# Altium project DC075B.PrjPcb (part 7 of 7)

## Sheet DC075B_CW_OUTPUTS.SchDoc: CW OUTPUTS
size 558 x 431 mm; DrawnBy: Praveen Aroul; DocumentNumber: 12; SheetNumber: 12; SheetTotal: 13; PageSetup: Record=PageOptions|CenterHorizontal=True|CenterVertical=True|PrintScale=1.00|XCorrection=1.00|YCorrection=1.00|PrintKind=0|BorderSize=5000000|LeftOffset=0|BottomOffset=0|Orientation=2|PaperLength=1000|PaperWidth=1000|Scale=100|PaperSource=15|PrintQuality=600|MediaType=1|DitherType=10|PaperKind=Letter|PrintScaleMode=1
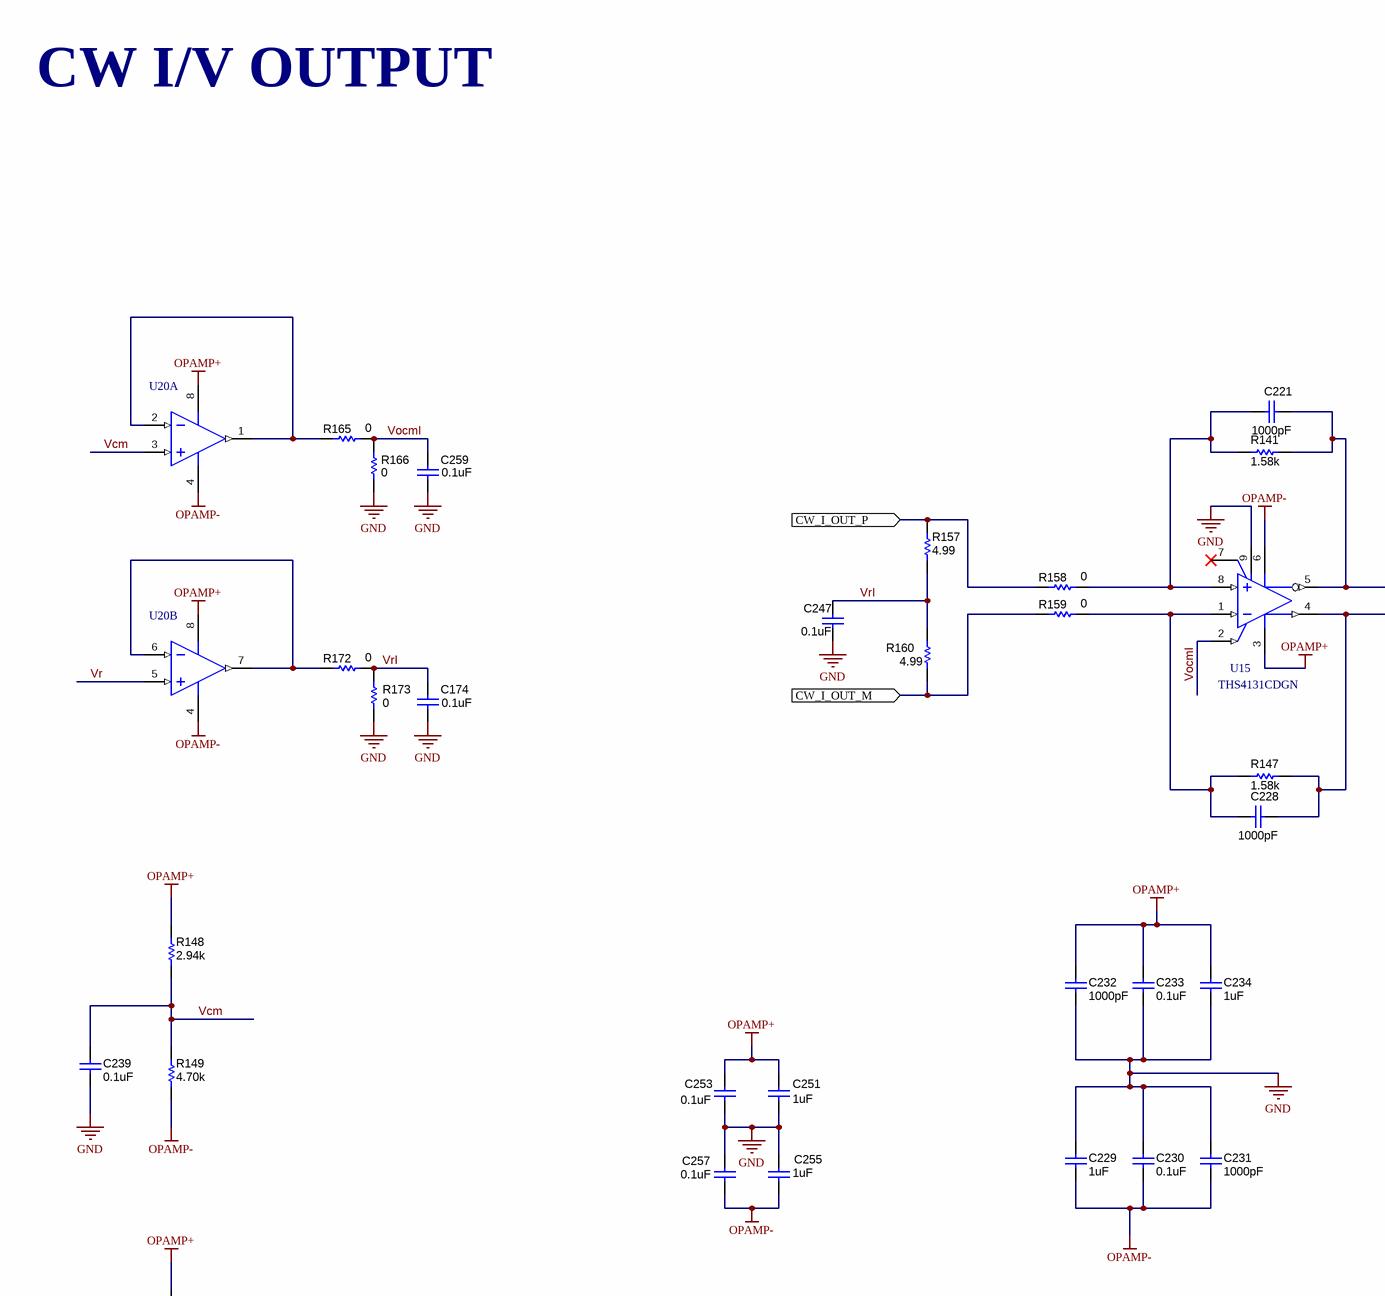
[diagram p27: DC075B_CW_OUTPUTS.SchDoc, top left]
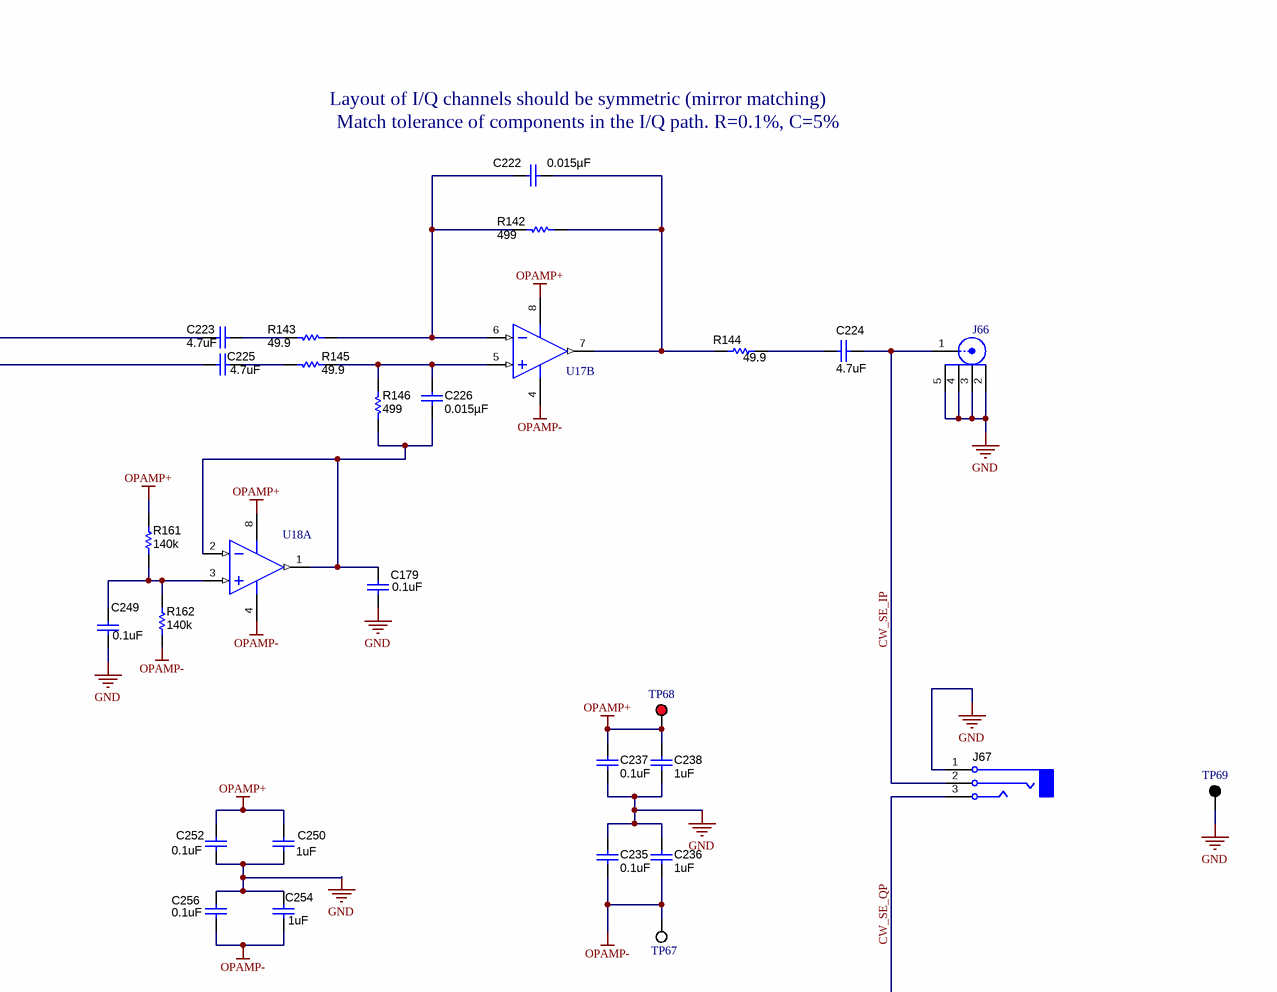
[diagram p28: DC075B_CW_OUTPUTS.SchDoc, top right]
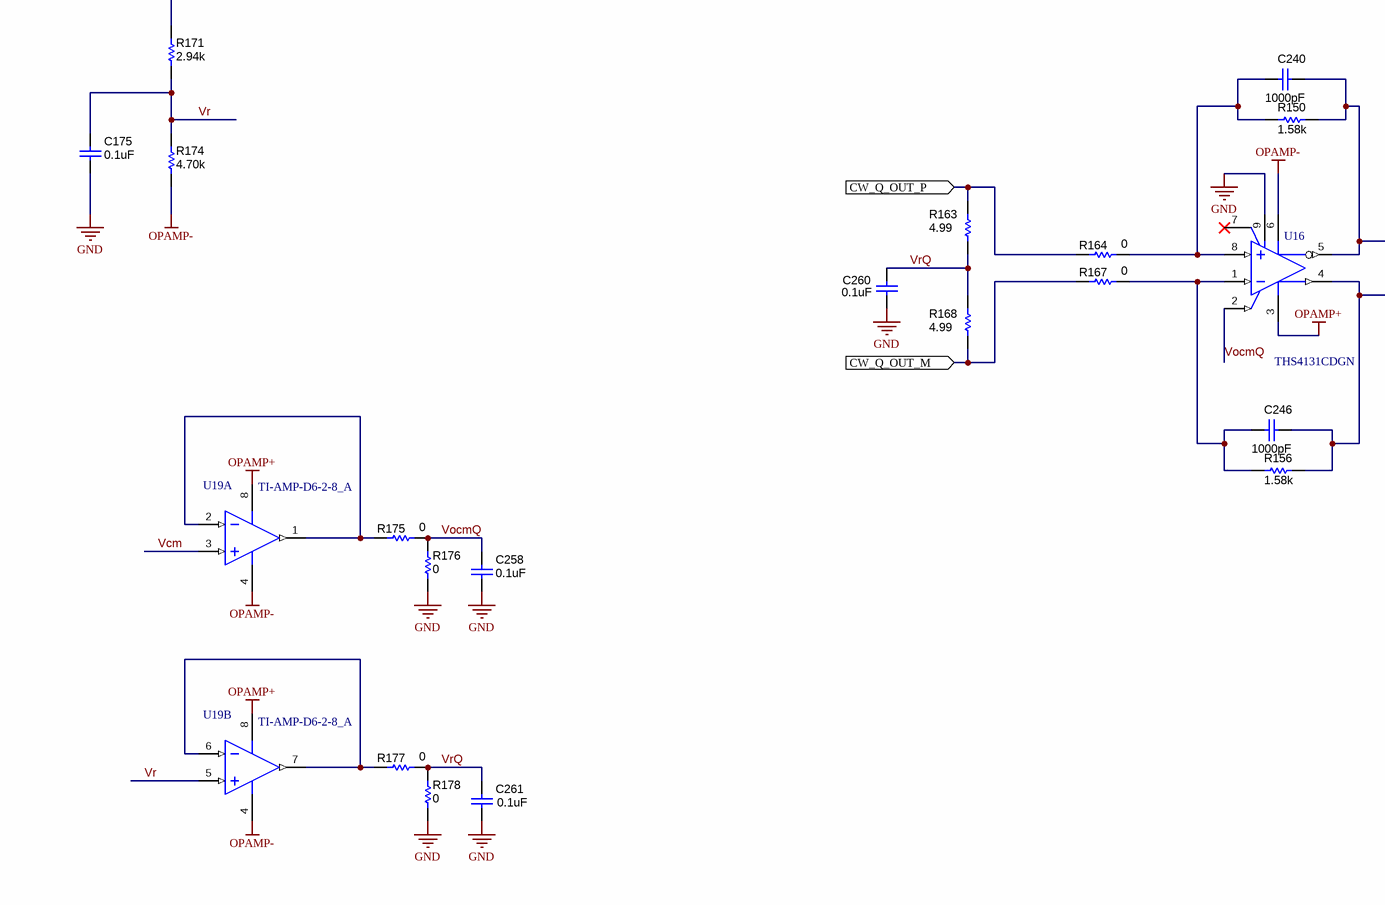
[diagram p29: DC075B_CW_OUTPUTS.SchDoc, bottom left]
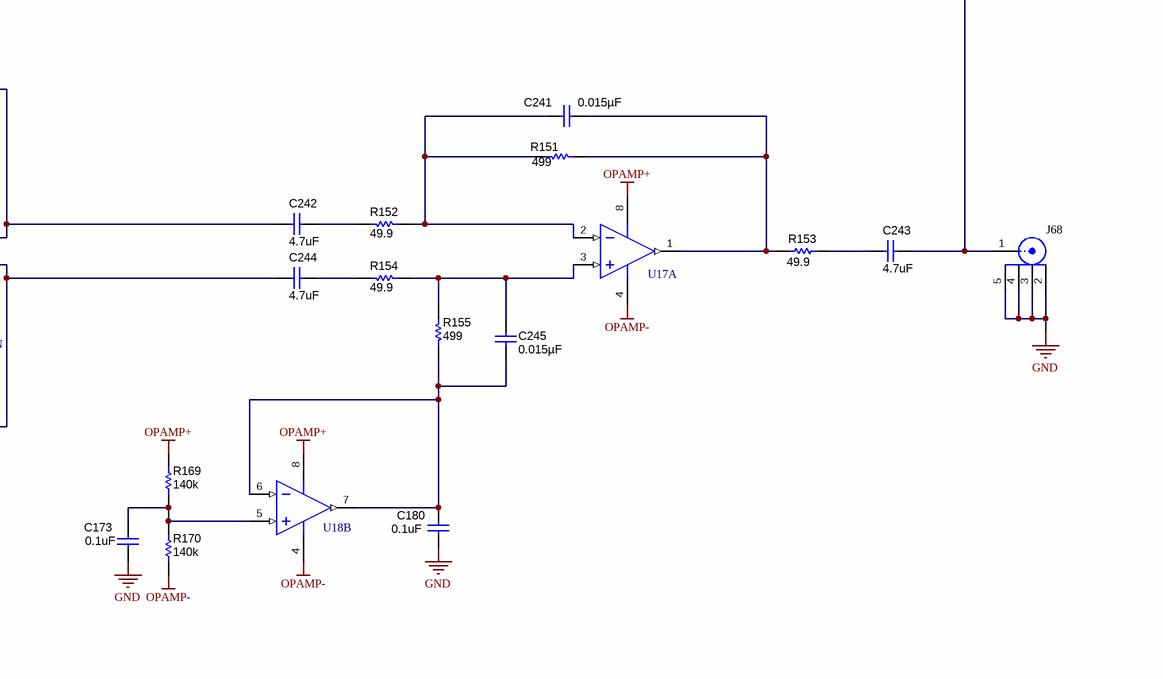
[diagram p30: DC075B_CW_OUTPUTS.SchDoc, bottom right]

### Parts
C173  value 0.1uF  [0402]  (hidden comment: Capacitor)
C174  value 0.1uF  [0402]  (hidden comment: Capacitor)
C175  value 0.1uF  [0402]  (hidden comment: Capacitor)
C179  value 0.1uF  [0402]  (hidden comment: Capacitor)
C180  value 0.1uF  [0402]  (hidden comment: Capacitor)
C221  ValueDisplayed: 1000pF  [0402]  (hidden comment: 885012205044)
C222  ValueDisplayed: 0.015µF  [0402]  (hidden comment: C0402C153J4RAC7867)
C223  ValueDisplayed: 4.7uF  [0603]  (hidden comment: Capacitor)
C224  ValueDisplayed: 4.7uF  [0603]  (hidden comment: Capacitor)
C225  ValueDisplayed: 4.7uF  [0603]  (hidden comment: Capacitor)
C226  ValueDisplayed: 0.015µF  [0402]  (hidden comment: C0402C153J4RAC7867)
C228  ValueDisplayed: 1000pF  [0402]  (hidden comment: 885012205044)
C229  value 1uF  [0603_HV]  (hidden comment: Capacitor)
C230  value 0.1uF  [0402]  (hidden comment: Capacitor)
C231  ValueDisplayed: 1000pF  [0402]  (hidden comment: 885012205044)
C232  ValueDisplayed: 1000pF  [0402]  (hidden comment: 885012205044)
C233  value 0.1uF  [0402]  (hidden comment: Capacitor)
C234  value 1uF  [0603_HV]  (hidden comment: Capacitor)
C235  value 0.1uF  [0402]  (hidden comment: Capacitor)
C236  value 1uF  [0603_HV]  (hidden comment: Capacitor)
C237  value 0.1uF  [0402]  (hidden comment: Capacitor)
C238  value 1uF  [0603_HV]  (hidden comment: Capacitor)
C239  value 0.1uF  [0402]  (hidden comment: Capacitor)
C240  ValueDisplayed: 1000pF  [0402]  (hidden comment: 885012205044)
C241  ValueDisplayed: 0.015µF  [0402]  (hidden comment: C0402C153J4RAC7867)
C242  ValueDisplayed: 4.7uF  [0603]  (hidden comment: Capacitor)
C243  ValueDisplayed: 4.7uF  [0603]  (hidden comment: Capacitor)
C244  ValueDisplayed: 4.7uF  [0603]  (hidden comment: Capacitor)
C245  ValueDisplayed: 0.015µF  [0402]  (hidden comment: C0402C153J4RAC7867)
C246  ValueDisplayed: 1000pF  [0402]  (hidden comment: 885012205044)
C247  value 0.1uF  [0402]  (hidden comment: Capacitor)
C249  value 0.1uF  [0402]  (hidden comment: Capacitor)
C250  value 1uF  [0603_HV]  (hidden comment: Capacitor)
C251  value 1uF  [0603_HV]  (hidden comment: Capacitor)
C252  value 0.1uF  [0402]  (hidden comment: Capacitor)
C253  value 0.1uF  [0402]  (hidden comment: Capacitor)
C254  value 1uF  [0603_HV]  (hidden comment: Capacitor)
C255  value 1uF  [0603_HV]  (hidden comment: Capacitor)
C256  value 0.1uF  [0402]  (hidden comment: Capacitor)
C257  value 0.1uF  [0402]  (hidden comment: Capacitor)
C258  value 0.1uF  [0402]  (hidden comment: Capacitor)
C259  value 0.1uF  [0402]  (hidden comment: Capacitor)
C260  value 0.1uF  [0402]  (hidden comment: Capacitor)
C261  value 0.1uF  [0402]  (hidden comment: Capacitor)
J66  5-1814832-1  [TE_5-1814832-1]  (value not drawn)
J67  Audio_T3R2S1  [KYCON_STX-3000]  (value not drawn)
J68  5-1814832-1  [TE_5-1814832-1]  (value not drawn)
R141  ValueDisplayed: 1.58k  [0402]  (hidden comment: CRCW04021K58FKED)
R142  ValueDisplayed: 499  [0402]  (hidden comment: Resistor)
R143  ValueDisplayed: 49.9  [0402]  (hidden comment: Resistor)
R144  value 49.9  [0402]  (hidden comment: Resistor)
R145  ValueDisplayed: 49.9  [0402]  (hidden comment: Resistor)
R146  ValueDisplayed: 499  [0402]  (hidden comment: Resistor)
R147  ValueDisplayed: 1.58k  [0402]  (hidden comment: CRCW04021K58FKED)
R148  ValueDisplayed: 2.94k  [0402]  (hidden comment: CRCW04022K94FKED)
R149  ValueDisplayed: 4.70k  [0402]  (hidden comment: Resistor)
R150  ValueDisplayed: 1.58k  [0402]  (hidden comment: CRCW04021K58FKED)
R151  ValueDisplayed: 499  [0402]  (hidden comment: Resistor)
R152  ValueDisplayed: 49.9  [0402]  (hidden comment: Resistor)
R153  value 49.9  [0402]  (hidden comment: Resistor)
R154  ValueDisplayed: 49.9  [0402]  (hidden comment: Resistor)
R155  ValueDisplayed: 499  [0402]  (hidden comment: Resistor)
R156  ValueDisplayed: 1.58k  [0402]  (hidden comment: CRCW04021K58FKED)
R157  ValueDisplayed: 4.99  [0402]  (hidden comment: Resistor)
R158  value 0  [0402]  (hidden comment: Resistor)
R159  value 0  [0402]  (hidden comment: Resistor)
R160  ValueDisplayed: 4.99  [0402]  (hidden comment: Resistor)
R161  ValueDisplayed: 140k  [0402]  (hidden comment: Resistor)
R162  ValueDisplayed: 140k  [0402]  (hidden comment: Resistor)
R163  ValueDisplayed: 4.99  [0402]  (hidden comment: Resistor)
R164  value 0  [0402]  (hidden comment: Resistor)
R165  value 0  [0402]  (hidden comment: Resistor)
R166  value 0  [0402]  (hidden comment: Resistor)
R167  value 0  [0402]  (hidden comment: Resistor)
R168  ValueDisplayed: 4.99  [0402]  (hidden comment: Resistor)
R169  ValueDisplayed: 140k  [0402]  (hidden comment: Resistor)
R170  ValueDisplayed: 140k  [0402]  (hidden comment: Resistor)
R171  ValueDisplayed: 2.94k  [0402]  (hidden comment: CRCW04022K94FKED)
R172  value 0  [0402]  (hidden comment: Resistor)
R173  value 0  [0402]  (hidden comment: Resistor)
R174  ValueDisplayed: 4.70k  [0402]  (hidden comment: Resistor)
R175  value 0  [0402]  (hidden comment: Resistor)
R176  value 0  [0402]  (hidden comment: Resistor)
R177  value 0  [0402]  (hidden comment: Resistor)
R178  value 0  [0402]  (hidden comment: Resistor)
TP67  5002  [Keystone5002]  (value not drawn)
TP68  5000  [Keystone5000]  (value not drawn)
TP69  5001  [Keystone5001]  (value not drawn)
U15  THS4131CDGN  [DGN0008D_N]
U16  THS4131CDGN  [DGN0008D_N]
U17  TI-AMP-D6-2-8_A  [D0008A_N]  (value not drawn)  (parts A,B of 2)
U18  TI-AMP-D6-2-8_A  [D0008A_N]  (value not drawn)  (parts A,B of 2)
U19  TI-AMP-D6-2-8_A  [D0008A_N]  (parts A,B of 2)
U20  TI-AMP-D6-2-8_A  [D0008A_N]  (value not drawn)  (parts A,B of 2)

### Ports
CW_I_OUT_M (in), CW_I_OUT_P (in), CW_Q_OUT_M (in), CW_Q_OUT_P (in)

### Nets
GND: C173.1 C174.2 C175.1 C179.2 C180.2 C229.1 C230.1 C231.2 C232.2 C233.1 C234.1 C235.2 C236.2 C237.2 C238.2 C239.1 C247.2 C249.1 C250.2 C251.2 C252.2 C253.2 C254.1 C255.1 C256.1 C257.1 C258.2 C259.2 C260.2 C261.2 J66.2 J66.3 J66.4 J66.5 J67.1(SLEEVE) J68.2 J68.3 J68.4 J68.5 R166.2 R173.2 R176.2 R178.2 TP69.1 U15.9(EP) U16.9(EP)
OPAMP+: C232.1 C233.2 C234.2 C237.1 C238.1 C250.1 C251.1 C252.1 C253.1 R148.2 R161.2 R169.2 R171.2 TP68.1 U15.3(VCC+) U16.3(VCC+) U17.8(VS+) U18.8(VS+) U19.8(VS+) U20.8(VS+)
OPAMP-: C229.2 C230.2 C231.1 C235.1 C236.1 C254.2 C255.2 C256.2 C257.2 R149.1 R162.1 R170.1 R174.1 TP67.1 U15.6(VCC-) U16.6(VCC-) U17.4(VS-) U18.4(VS-) U19.4(VS-) U20.4(VS-)
CW_I_OUT_M: R159.2 R160.1 ; port CW_I_OUT_M
CW_I_OUT_P: R157.2 R158.2 ; port CW_I_OUT_P
CW_Q_OUT_M: R167.2 R168.1 ; port CW_Q_OUT_M
CW_Q_OUT_P: R163.2 R164.2 ; port CW_Q_OUT_P
CW_SE_IP: C224.1 J66.1 J67.2(TIP)
CW_SE_QP: C243.1 J67.3(RING) J68.1
Vcm: C239.2 R148.1 R149.2 U19.3(IN_A+) U20.3(IN_A+)
VocmI: C259.1 R165.1 R166.1 U15.2(VOCM)
VocmQ: C258.1 R175.1 R176.1 U16.2(VOCM)
Vr: C175.2 R171.1 R174.2 U19.5(IN_B+) U20.5(IN_B+)
VrI: C174.1 C247.1 R157.1 R160.2 R172.1 R173.1
VrQ: C260.1 C261.1 R163.1 R168.2 R177.1 R178.1
NetC173_2: C173.2 R169.1 R170.2 U18.5(IN_B+)
NetC179_1: C179.1 C226.1 R146.2 U18.1(OUT_A) U18.2(IN_A-)
NetC180_1: C180.1 C245.1 R155.2 U18.6(IN_B-) U18.7(OUT_B)
NetC221_1: C221.1 C223.2 R141.2 U15.5(VOUT-)
NetC221_2: C221.2 R141.1 R158.1 U15.8(VIN+)
NetC222_1: C222.1 R142.2 R143.2 U17.6(IN_B-)
NetC222_2: C222.2 R142.1 R144.1 U17.7(OUT_B)
NetC223_1: C223.1 R143.1
NetC224_2: C224.2 R144.2
NetC225_1: C225.1 R145.1
NetC225_2: C225.2 C228.1 R147.2 U15.4(VOUT+)
NetC226_2: C226.2 R145.2 R146.1 U17.5(IN_B+)
NetC228_2: C228.2 R147.1 R159.1 U15.1(VIN-)
NetC240_1: C240.1 C242.2 R150.2 U16.5(VOUT-)
NetC240_2: C240.2 R150.1 R164.1 U16.8(VIN+)
NetC241_1: C241.1 R151.1 R153.1 U17.1(OUT_A)
NetC241_2: C241.2 R151.2 R152.2 U17.2(IN_A-)
NetC242_1: C242.1 R152.1
NetC243_2: C243.2 R153.2
NetC244_1: C244.1 R154.1
NetC244_2: C244.2 C246.1 R156.2 U16.4(VOUT+)
NetC245_2: C245.2 R154.2 R155.1 U17.3(IN_A+)
NetC246_2: C246.2 R156.1 R167.1 U16.1(VIN-)
NetC249_2: C249.2 R161.1 R162.2 U18.3(IN_A+)
NetR165_2: R165.2 U20.1(OUT_A) U20.2(IN_A-)
NetR172_2: R172.2 U20.6(IN_B-) U20.7(OUT_B)
NetR175_2: R175.2 U19.1(OUT_A) U19.2(IN_A-)
NetR177_2: R177.2 U19.6(IN_B-) U19.7(OUT_B)

Not connected (* = marked no-connect by the designer): U15 7(NC)*; U16 7(NC)*

### Notes on the sheet
- CW I/V OUTPUT
- Layout of I/Q channels should be symmetric (mirror matching)
- (near C222) Match tolerance of components in the I/Q path. R=0.1%, C=5%
- Drawn By:
- SVN Rev:
- Number:
- TID #:
- Orderable:
- Rev:
- Sheet Title:
- File:
- Project Title:
- Designed for:
- Assembly Variant:
- Mod. Date:
- Sheet:
- Size:
- of
- C
- http://www.ti.com
- Texas Instruments and/or its licensors do not warrant the accuracy or completeness of this specification or any information contained therein. Texas Instruments and/or its licensors do not warrant that this design will meet the specifications, will be suitable for your application or fit for any particular purpose, or will operate in an implementation. Texas Instruments and/or its licensors do not warrant that the design is production worthy. You should completely validate and test your design implementation to confirm the system functionality for your application.
- Engineer:
- Contact:
- © Texas Instruments

### Library data of the parts
C173-C175 C179 C180 C230 C233 C235 C237 C239 C247 C249 C252 C253 C256-C261 = CMP-0006641-2: as C107-C126 on sheet DC075B_JESD_OUTPUT; CompType: Capacitor; PackageReference: 0402; RoHS: Y; MountType: SMT; ComponentLink1Description: Datasheet link; ComponentLink1URL: http://search.murata.co.jp/Ceramy/PnsearchViewAction.do?HnOFG=ON&HnNFG=ON&SEL_CNT=50&sLang=en&sKey=GRM155R71C104KA88D&x=9&y=9&search=startwith; ValueDisplayed: 0.1uF; Tolerance_%: 10%; Value2: 16V; Technology: Ceramic; TempCo: X7R; Cap_Case: 0402; Published: 2008-06-19; Publisher: Texas Instruments; LatestRevisionDate: 2017-03-09; Supplier 1: Digi-Key; Supplier Part Number 1: 490-3261-1-ND; Supplier 2: Newark; Supplier Part Number 2: 38K1647; Supplier 3: Mouser; Supplier Part Number 3: 81-GRM155R71C104KA88; AEC Qualified: ?; SizeY_mm: 0.5
C221 C228 C231 C232 C240 C246 = CMP-0006229-2: CAP, CERM, 1000 pF, 25 V, +/- 10%, X7R, 0402; Manufacturer: Wurth Elektronik; TaMin_C: -55°C; Polarized: N; SizeAreaWB_mm2: 3; Value1: Unknown; U/M: EA; Value: 1000pF; TaMax_C: 125°C; SizeZ_mm: 0.6; SizeX_mm: 1; SizeY_mm: 0.5; Value2: 25V; CompType: Capacitor; Cap_F: 1nF; AEC Category: Q200; Publisher: Texas Instruments; TempCo: X7R; Published: 2008-06-19; RoHS: Y; MountType: SMT; Supplier 1: Mouser; PackageReference: 0402; Tolerance_%: 10%; Cap_Case: 0402; SizeArea_mm2: 0.5; LatestRevisionDate: 2017-03-09; PartNumber: 885012205044; AEC Qualified: N; VDC_V: 25V; ComponentLink1Description: Datasheet link; AEC Grade: N/A; Supplier Part Number 1: 710-885012205044; Technology: Ceramic; ComponentLink1URL: http://katalog.we-online.de/pbs/datasheet/885012205044.pdf
C222 C226 C241 C245 = CMP-0085571-1: CAP, CERM, 0.015 µF, 16 V,+/- 5%, X7R, 0402; Manufacturer: Kemet; Polarized: N; Value: 0.015uF; U/M: EA; Cap_F: 15nF; VDC_V: 16V; TaMin_C: -55°C; TaMax_C: 125°C; SizeArea_mm2: 0.5; SizeAreaWB_mm2: 3; SizeX_mm: 1; SizeZ_mm: 0.6; AEC Category: Q200; CompType: Capacitor; PartNumber: C0402C153J4RAC7867; PackageReference: 0402; RoHS: Y; Tolerance_%: 5%; Value2: 16V; MountType: SMT; Technology: Ceramic; TempCo: X7R; Cap_Case: 0402; ComponentLink1Description: Datasheet link; ComponentLink1URL: https://api.kemet.com/component-edge/download/specsheet/C0402C153J4RACTU.pdf; SizeY_mm: 0.5; AEC Qualified: N; AEC Grade: N/A
C223-C225 C242-C244 = CMP-0006949-5: CAP, CERM, 4.7 uF, 10 V, +/- 10%, X5R, 0603; PartNumber: C0603C475K8PACTU; Manufacturer: Kemet; Polarized: N; Value: 4.7uF; U/M: EA; Cap_F: 4.7µF; ESR_ohm: 6m; Value1: 0.006 ohm; VDC_V: 10V; IRMS_A: 7.24A; TaMin_C: -55°C; TaMax_C: 85°C; AEC Category: Q200; SizeArea_mm2: 1.28; SizeAreaWB_mm2: 4.68; SizeX_mm: 1.6; SizeY_mm: 0.8; SizeZ_mm: 1; CompType: Capacitor; PackageReference: 0603; RoHS: Y; Tolerance_%: 10%; Value2: 10V; MountType: SMT; Technology: Ceramic; TempCo: X5R; Cap_Case: 0603; Published: 2008-06-19; Publisher: Texas Instruments; LatestRevisionDate: 2017-03-09; ComponentLink1Description: Datasheet link; ComponentLink1URL: http://www.kemet.com/kemet/web/homepage/kechome.nsf/vapubfiles/F3102_Y5V.pdf/$file/F3102_Y5V.pdf; Supplier 1: Digi-Key; Supplier Part Number 1: 399-5503-1-ND; Supplier 2: Mouser; Supplier Part Number 2: 80-C0603C475K8P; Supplier 3: Farnell; Supplier Part Number 3: 1572625; AEC Qualified: ?
C229 C234 C236 C238 C250 C251 C254 C255 = CMP-0006868-5: CAP, CERM, 1 uF, 16 V, +/- 10%, X5R, 0603; PartNumber: C0603C105K4PACTU; Manufacturer: Kemet; Polarized: N; U/M: EA; Cap_F: 1µF; Value1: Unknown; VDC_V: 16V; TaMin_C: -55°C; TaMax_C: 85°C; Cap_Case: 0603; AEC Category: Q200; SizeArea_mm2: 1.28; SizeAreaWB_mm2: 4.68; SizeX_mm: 1.6; SizeY_mm: 0.8; SizeZ_mm: 1; CompType: Capacitor; PackageReference: 0603; RoHS: Y; MountType: SMT; ComponentLink1Description: Datasheet link; ComponentLink1URL: http://www.kemet.com/kemet/web/homepage/kechome.nsf/vapubfiles/F3102_Y5V.pdf/$file/F3102_Y5V.pdf; ValueDisplayed: 1uF; Tolerance_%: 10%; Value2: 16V; Technology: Ceramic; TempCo: X5R; Published: 2008-06-19; Publisher: Texas Instruments; LatestRevisionDate: 2017-03-09; Supplier 1: Digi-Key; Supplier Part Number 1: 399-5090-1-ND; Supplier 2: Mouser; Supplier Part Number 2: 80-C0603C105K4P; Supplier 3: Farnell; Supplier Part Number 3: 1288256; AEC Qualified: ?
J66 J68 = CMP-0054990-1: as J59 on sheet DC075B_DTGC_CPLD; PartNumber: 5-1814832-1; PackageReference: SMA Straight PCB Socket Die Cast, TH; CompType: SMA; RoHS: Y; MountType: TH; ComponentLink1Description: Datasheet URL; ComponentLink1URL: http://www.te.com/commerce/DocumentDelivery/DDEController?Action=srchrtrv&DocNm=1814832&DocType=Customer+Drawing&DocLang=English; Supplier 1: Digi-Key; Supplier Part Number 1: A97594-ND; Supplier 2: Newark; Supplier Part Number 2: 78M7270; Supplier 3: Mouser; Supplier Part Number 3: 571-5-1814832-1; Green_EU RoHS-2: Incomplete; Green_EU RoHS: Passed with Exemption; Publisher: Texas Instruments; LatestRevisionDate: 26/05/2017
J67 = CMP-0075053-1: Audio Jack, 3.5 mm, Stereo, R/A, TH; Manufacturer: Kycon Inc; CompType: Audio Connector; CNHeader: False; CT: True; Green_Lifecycle: Not Set; Green_REACh: Incomplete; PartNumber: STX-3000; PackageReference: Connector, 3-Leads, 3.5mm Stereo Jack R/A, TH; RoHS: Y; MountType: TH; ComponentLink1Description: Datasheet URL; ComponentLink1URL: http://domino2.kycon.com/Pub_Eng_Draw/STX-3000.pdf; Publisher: Texas Instruments; LatestRevisionDate: 2017-07-12; Supplier 1: Mouser; Supplier Part Number 1: 806-STX-3000; Green_EU RoHS-2: Incomplete; Green_EU RoHS: Incomplete
R141 R147 R150 R156 = CMP-0026090-3: RES, 1.58 k, 1%, 0.063 W, AEC-Q200 Grade 0, 0402; Manufacturer: Vishay-Dale; Power_W: 63mW; TempCo: 100 ppm/C; Value_Code: 1k58; Value: 1.58k; EIA_Code: E96; SizeX_mm: 1; SizeY_mm: 0.5; SizeZ_mm: 0.6; Value2: 0.063W; AEC Qualified: Y; VDC_V: 50V; AEC Category: Q200; AEC Grade: 0; Supplier Part Number 2: 52K6578; Supplier 2: Newark; Supplier Part Number 3: 71-CRCW0402-1.58K-E3; Supplier 3: Mouser; RoHS: E; Value1: 1%; MountType: SMT; Supplier 1: Digi-Key; PackageReference: 0402; Tolerance_%: 1%; Res_ohm: 1.58k; SizeArea_mm2: 0.5; CompType: Resistor; PartNumber: CRCW04021K58FKED; ComponentLink1Description: Datasheet link; Supplier Part Number 1: 541-1.58KLCT-ND; Technology: Thick Film; ComponentLink1URL: http://www.vishay.com/docs/20035/dcrcwe3.pdf
R142 R146 R151 R155 = CMP-0026402-2: RES, 499, 1%, 0.063 W, AEC-Q200 Grade 0, 0402; PartNumber: CRCW0402499RFKED; Manufacturer: Vishay-Dale; Value: 499; Value_Code: 499R; Power_W: 63mW; Value2: 0.063W; VDC_V: 50V; TempCo: 100 ppm/C; EIA_Code: E96; AEC Category: Q200; AEC Grade: 0; AEC Qualified: Y; SizeArea_mm2: 0.5; SizeX_mm: 1; SizeZ_mm: 0.6; CompType: Resistor; PackageReference: 0402; RoHS: E; Res_ohm: 499; Tolerance_%: 1%; Value1: 1%; MountType: SMT; Technology: Thick Film; ComponentLink1Description: Datasheet link; ComponentLink1URL: http://www.vishay.com/docs/20035/dcrcwe3.pdf; Supplier 1: Digi-Key; Supplier Part Number 1: 541-499LCT-ND; Supplier 2: Newark; Supplier Part Number 2: 52K7117; Supplier 3: Mouser; Supplier Part Number 3: 71-CRCW0402-499-E3; SizeY_mm: 0.5
R143 R145 R152 R154 = CMP-0026404-2: RES, 49.9, 1%, 0.063 W, AEC-Q200 Grade 0, 0402; PartNumber: CRCW040249R9FKED; Manufacturer: Vishay-Dale; Value: 49.9; Value_Code: 49R9; Power_W: 63mW; Value2: 0.063W; VDC_V: 50V; TempCo: 100 ppm/C; EIA_Code: E96; AEC Category: Q200; AEC Grade: 0; AEC Qualified: Y; SizeArea_mm2: 0.5; SizeX_mm: 1; SizeZ_mm: 0.6; CompType: Resistor; PackageReference: 0402; RoHS: E; Res_ohm: 49.9; Tolerance_%: 1%; Value1: 1%; MountType: SMT; Technology: Thick Film; ComponentLink1Description: Datasheet link; ComponentLink1URL: http://www.vishay.com/docs/20035/dcrcwe3.pdf; Supplier 1: Digi-Key; Supplier Part Number 1: 541-49.9LCT-ND; Supplier 2: Newark; Supplier Part Number 2: 52K7114; Supplier 3: Mouser; Supplier Part Number 3: 71-CRCW0402-49.9-E3; SizeY_mm: 0.5
R144 R153 = CMP-0026404-2: as R113 on sheet DC075B_DTGC_CPLD; ComponentLink1Description: Datasheet link; ComponentLink1URL: http://www.vishay.com/docs/20035/dcrcwe3.pdf; CompType: Resistor; MountType: SMT; PackageReference: 0402; RoHS: E; ValueDisplayed: 49.9; Res_ohm: 49.9; Tolerance_%: 1%; Value1: 1%; Technology: Thick Film; Supplier 1: Digi-Key; Supplier Part Number 1: 541-49.9LCT-ND; Supplier 2: Newark; Supplier Part Number 2: 52K7114; Supplier 3: Mouser; Supplier Part Number 3: 71-CRCW0402-49.9-E3; SizeY_mm: 0.5
R148 R171 = CMP-0026244-2: RES, 2.94 k, 1%, 0.063 W, AEC-Q200 Grade 0, 0402; Manufacturer: Vishay-Dale; Power_W: 63mW; TempCo: 100 ppm/C; Value_Code: 2k94; Value: 2.94k; EIA_Code: E96; SizeX_mm: 1; SizeY_mm: 0.5; SizeZ_mm: 0.6; Value2: 0.063W; AEC Qualified: Y; VDC_V: 50V; AEC Category: Q200; AEC Grade: 0; ComponentLink1URL: http://www.vishay.com/docs/20035/dcrcwe3.pdf; Supplier Part Number 2: 52K6814; Supplier 2: Newark; Supplier Part Number 3: 71-CRCW0402-2.94K-E3; Supplier 3: Mouser; RoHS: E; Value1: 1%; MountType: SMT; Supplier 1: Digi-Key; PackageReference: 0402; Tolerance_%: 1%; Res_ohm: 2.94k; SizeArea_mm2: 0.5; CompType: Resistor; PartNumber: CRCW04022K94FKED; ComponentLink1Description: Datasheet link; Supplier Part Number 1: 541-2.94KLCT-ND; Technology: Thick Film
R149 R174 = CMP-0026700-1: RES, 4.70 k, 1%, 0.1 W, 0402; PartNumber: ERJ-2RKF4701X; Manufacturer: Panasonic; Value: 4.70k; Res_ohm: 4.7k; Value_Code: 4k70; Power_W: 100mW; Value2: 0.1W; VDC_V: 50V; TempCo: 100 ppm/C; SizeArea_mm2: 0.5; SizeX_mm: 1; SizeZ_mm: 0.6; U/M: EA; AEC Category: Q200; CompType: Resistor; PackageReference: 0402; RoHS: Y; Tolerance_%: 1%; Value1: 1%; MountType: SMT; Technology: Thick Film; SizeY_mm: 0.5; Published: 2008-06-26; Publisher: Texas Instruments; LatestRevisionDate: 2017-03-09; ComponentLink1Description: Datasheet link; ComponentLink1URL: http://industrial.panasonic.com/www-data/pdf/AOA0000/AOA0000CE2.pdf; Supplier 1: Digi-Key; Supplier Part Number 1: P4.70KLCT-ND; Supplier 2: Newark; Supplier Part Number 2: 64R5288; Supplier 3: Mouser; Supplier Part Number 3: 667-ERJ-2RKF4701X; AEC Qualified: ?
R157 R160 R163 R168 = CMP-0026434-2: RES, 4.99, 1%, 0.063 W, AEC-Q200 Grade 0, 0402; PartNumber: CRCW04024R99FKED; Manufacturer: Vishay-Dale; Value: 4.99; Value_Code: 4R99; Power_W: 63mW; Value2: 0.063W; VDC_V: 50V; TempCo: 100 ppm/C; EIA_Code: E96; AEC Category: Q200; AEC Qualified: Y; AEC Grade: 0; SizeArea_mm2: 0.5; SizeX_mm: 1; SizeZ_mm: 0.6; CompType: Resistor; PackageReference: 0402; RoHS: E; Res_ohm: 4.99; Tolerance_%: 1%; Value1: 1%; MountType: SMT; Technology: Thick Film; ComponentLink1Description: Datasheet link; ComponentLink1URL: http://www.vishay.com/docs/20035/dcrcwe3.pdf; Supplier 1: Digi-Key; Supplier Part Number 1: 541-4.99LLCT-ND; Supplier 2: Mouser; Supplier Part Number 2: 71-CRCW0402-4.99-E3; Supplier 3: Farnell; Supplier Part Number 3: 1862028; SizeY_mm: 0.5
R158 R159 R164-R167 R172 R173 R175-R178 = CMP-0026822-3: as R112 on sheet DC075B_DTGC_CPLD; ComponentLink1Description: Datasheet link; ComponentLink1URL: http://www.vishay.com/docs/20035/dcrcwe3.pdf; CompType: Resistor; MountType: SMT; PackageReference: 0402; RoHS: E; ValueDisplayed: 0; Res_ohm: 0; Tolerance_%: 5%; Value1: 5%; Technology: Thick Film; Supplier 1: Digi-Key; Supplier Part Number 1: 541-0.0JCT-ND; Supplier 2: Newark; Supplier Part Number 2: 52K6543; Supplier 3: Mouser; Supplier Part Number 3: 71-CRCW0402-0-E3; AEC Grade: 0; SizeY_mm: 0.5
R161 R162 R169 R170 = CMP-0026009-3: RES, 140 k, 1%, 0.063 W, AEC-Q200 Grade 0, 0402; PartNumber: CRCW0402140KFKED; Manufacturer: Vishay-Dale; Value: 140k; Power_W: 63mW; Value2: 0.063W; VDC_V: 50V; TempCo: 100 ppm/C; EIA_Code: E96; AEC Category: Q200; AEC Grade: 0; AEC Qualified: Y; SizeArea_mm2: 0.5; SizeX_mm: 1; SizeZ_mm: 0.6; CompType: Resistor; PackageReference: 0402; RoHS: E; Res_ohm: 140k; Value_Code: 140k; Tolerance_%: 1%; Value1: 1%; MountType: SMT; Technology: Thick Film; ComponentLink1Description: Datasheet link; ComponentLink1URL: http://www.vishay.com/docs/20035/dcrcwe3.pdf; Supplier 1: Digi-Key; Supplier Part Number 1: 541-140KLCT-ND; Supplier 2: Newark; Supplier Part Number 2: 52K6697; Supplier 3: Mouser; Supplier Part Number 3: 71-CRCW0402-140K-E3; SizeY_mm: 0.5
TP67 = CMP-0055139-1: Test Point, Miniature, White, TH; Manufacturer: Keystone; CNHeader: FALSE; ContactFinish: Silver; CT: TRUE; Green_Lifecycle: Active; Green_REACh: Passed; PartNumber: 5002; PackageReference: White Miniature Testpoint; CompType: Test Point; RoHS: Y; MountType: TH; ComponentLink1Description: Datasheet URL; ComponentLink1URL: http://www.keyelco.com/userAssets/file/M60-2p60.pdf; Publisher: Texas Instruments; LatestRevisionDate: 26/05/2017; Supplier 1: Digi-Key; Supplier Part Number 1: 36-5002-ND; Supplier 2: Newark; Supplier Part Number 2: 82H9632; Supplier 3: Mouser; Supplier Part Number 3: 534-5002; Color: White; Green_EU RoHS-2: Passed; Green_EU RoHS: Passed
TP68 = CMP-0055137-1: Test Point, Miniature, Red, TH; Manufacturer: Keystone; CNHeader: FALSE; ContactFinish: Silver; CT: TRUE; Green_Lifecycle: Active; Green_REACh: Passed; PartNumber: 5000; PackageReference: Red Miniature Testpoint; CompType: Test Point; RoHS: Y; MountType: TH; ComponentLink1Description: Datasheet URL; ComponentLink1URL: http://www.keyelco.com/userAssets/file/M60-2p60.pdf; Publisher: Texas Instruments; LatestRevisionDate: 26/05/2017; Supplier 1: Digi-Key; Supplier Part Number 1: 36-5000-ND; Supplier 2: Mouser; Supplier Part Number 2: 534-5000; Color: Red; Green_EU RoHS-2: Incomplete; Green_EU RoHS: Passed
TP69 = CMP-0055138-1: Test Point, Miniature, Black, TH; Manufacturer: Keystone; CNHeader: FALSE; ContactFinish: Silver; CT: TRUE; Green_Lifecycle: Active; Green_REACh: Passed; PartNumber: 5001; PackageReference: Black Miniature Testpoint; CompType: Test Point; RoHS: Y; MountType: TH; ComponentLink1Description: Datasheet URL; ComponentLink1URL: http://www.keyelco.com/userAssets/file/M60-2p60.pdf; Publisher: Texas Instruments; LatestRevisionDate: 26/05/2017; Supplier 1: Digi-Key; Supplier Part Number 1: 36-5001-ND; Supplier 2: Mouser; Supplier Part Number 2: 534-5001; Color: Black; Green_EU RoHS-2: Incomplete; Green_EU RoHS: Passed
U15 U16 = CMP-0039778-1: Fully Differential Input / Output Low Noise Amplifier, 5 to 30 V, 0 to 70 degC, 8-pin SOP (DGN8), Green (RoHS & no Sb/Br); Manufacturer: Texas Instruments; Settling Time (0.1%)(Typ)(ns): 78; Slew Rate(Typ)(V/us): 52; BW @ Acl(MHz): 150; Offset Voltage Drift (+/-)(Max)(uV/Degrees Celsius: 4.5; THD (Fc is 1 MHz)(Typ)(dB): -80; SubFamily: Fully Differential Amplifier; Iq per channel(Max)(mA): 16; Vn at Flatband(Typ)(nV/rtHz): 1.3; Vs(Max)(V): 30; 3rd Harmonic(dBc): 82; Vio(Max)(mV): 2; Number of Channels: 1; 2nd Harmonic(dBc): 88; Io(Typ)(mA): 85; Vs(Min)(V): 5; DatasheetVersion: SLOS318H; Code_JEDEC: MO-187; ComponentLink1Description: Manufacturer URL; ComponentLink1URL: http://www.ti.com/; PackageReference: DGN0008D; ComponentLink3URL: http://www.ti.com/litv/pdf/mpds046e; PartNumber: THS4131CDGN; ComponentLink2URL: http://www.ti.com/general/docs/lit/getliterature.tsp?genericPartNumber=THS4131&fileType=pdf; Mounting Technology: Surface Mount; Eco-Plan: Green (RoHS & no Sb/Br); @ MHz: 1; ComponentLink3Description: Package Specification; PackageDescription: 8-Pin Plastic Small Outline, Body 3 x 3 mm, Pitch 0.65 mm; PackageVersion: 4073271/F, 05/2011; ComponentLink2Description: Datasheet
U17-U20 = CMP-0039949-1: Dual, High Gain Bandwidth, High Output Current, Operational Amplifier with Current Limit, 5 to 12 V, -40 to 85 degC, 8-pin SOIC (D8), Green (RoHS & no Sb/Br); Manufacturer: Texas Instruments; PartNumber: OPA2614ID; 2nd Harmonic(dBc): 92; 3rd Harmonic(dBc): 110; @ MHz: 1; Acl, min stable gain(V/V): 2; BW @ Acl(MHz): 180; Iib(Max)(nA): 14500; Io(Typ)(mA): 350; Iq per channel(Max)(mA): 6.5; Settling Time (0.1%)(Typ)(ns): 35; Slew Rate(Typ)(V/us): 145; Sub Family: High Output Current Amplifier (>=50mA), High Speed Amplifier (>=50MHz); THD (Fc is 1 MHz)(Typ)(dB): -75; Vn at Flatband(Typ)(nV/rtHz): 1.8; Vs(Max)(V): 12; Vs(Min)(V): 5; DatasheetVersion: SBOS305D; PackageVersion: 4040047-3/M, 06/2011; PackageReference: D0008A; PackageDescription: 8-Pin Plastic Small Outline, Body 4.9 x 3.9 mm, Pitch 1.27 mm; Eco-Plan: Green (RoHS & no Sb/Br); Number of Channels: 2; Vio(Max)(mV): 1; Code_JEDEC: MS-012; ComponentLink1Description: Manufacturer URL; ComponentLink1URL: http://www.ti.com/; ComponentLink2Description: Datasheet; ComponentLink2URL: http://www.ti.com/general/docs/lit/getliterature.tsp?genericPartNumber=OPA2614&fileType=pdf; ComponentLink3Description: Package Specification; ComponentLink3URL: http://www.ti.com/litv/pdf/msoi002j; Mounting Technology: Surface Mount

## Sheet DC075B_HARDWARE.SchDoc: HARDWARE
size 558 x 431 mm; Date: Not shown in title block; ApprovedBy: Not shown in title block; CheckedBy: Not shown in title block; Author: Not shown in title block; CompanyName: Not shown in title block; DrawnBy: Praveen Aroul; Engineer: Not shown in title block; Organization: Not shown in title block; Address1: Not shown in title block; Address2: Not shown in title block; Address3: Not shown in title block; Address4: Not shown in title block; DocumentNumber: 13; Revision: Use project parameter SCH_Rev; SheetNumber: 13; SheetTotal: 13; PageSetup: Record=PageOptions|CenterHorizontal=True|CenterVertical=True|PrintScale=1.00|XCorrection=1.00|YCorrection=1.00|PrintKind=0|BorderSize=5000000|LeftOffset=0|BottomOffset=0|Orientation=2|PaperLength=1000|PaperWidth=1000|Scale=100|PaperSource=15|PrintQuality=600|MediaType=1|DitherType=10|PaperKind=Letter|PrintScaleMode=1; CurrentTime: Not shown in title block; CurrentDate: Not shown in title block; Time: Not shown in title block; DocumentFullPathAndName: Not shown in title block; DocumentName: Not shown in title block; ModifiedDate: Not shown in title block; ImagePath: Not shown in title block
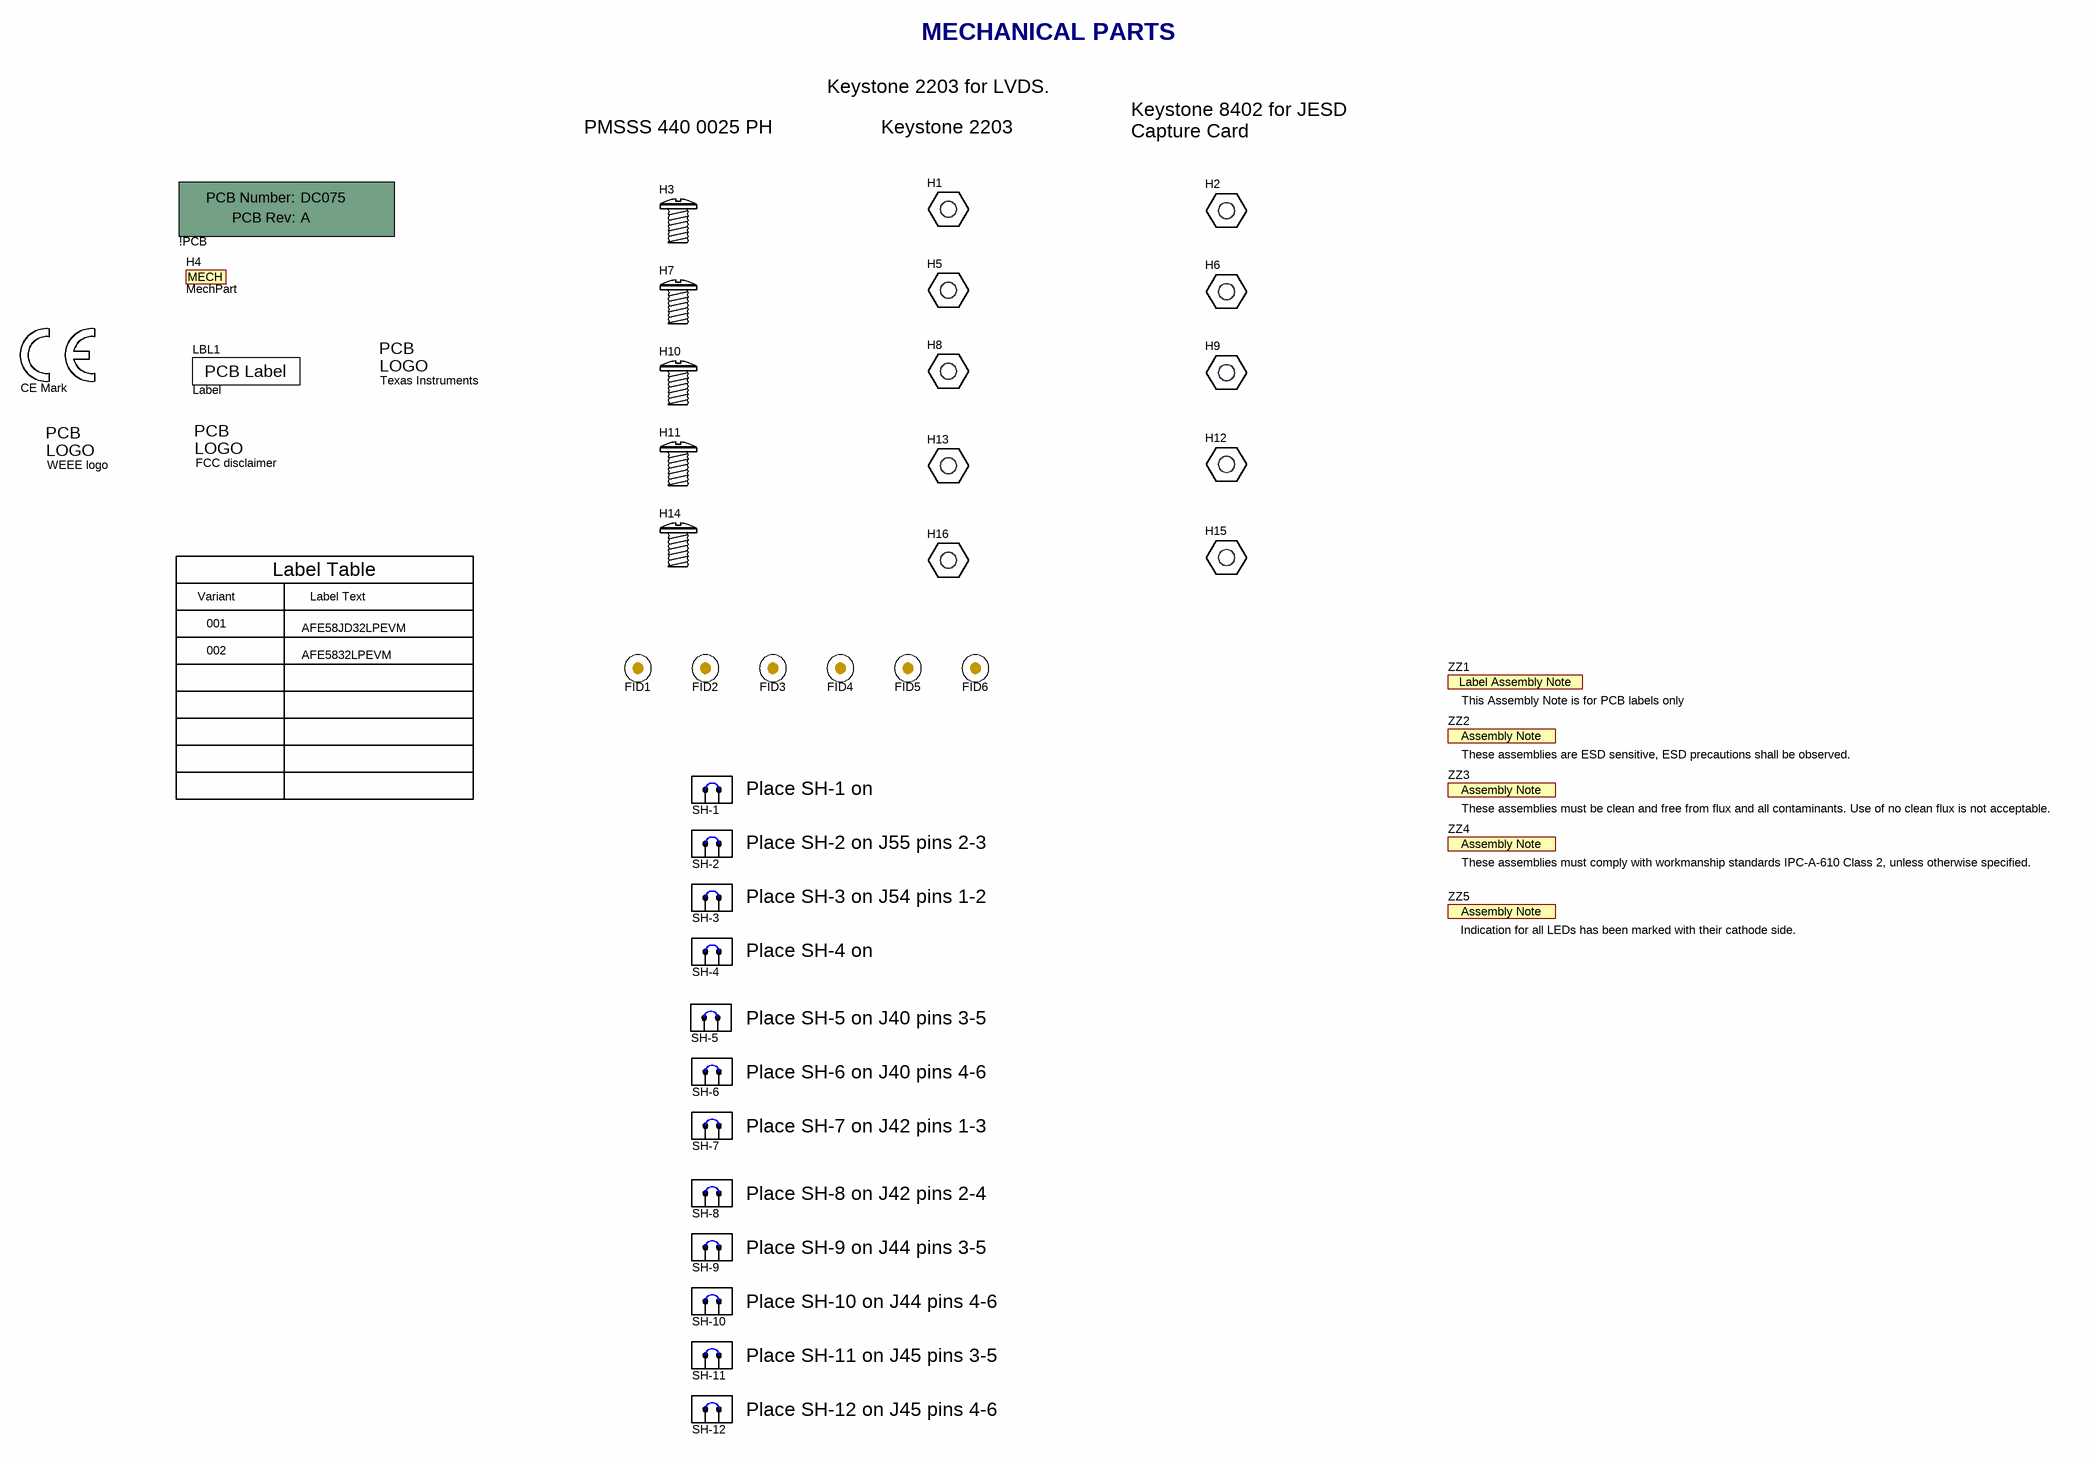
[diagram p31: DC075B_HARDWARE.SchDoc]

### Parts
!PCB  Printed Circuit Board  (value not drawn)  (mechanical)
FID1  Fiducial  [Fiducial10-20]  (value not drawn)
FID2  Fiducial  [Fiducial10-20]  (value not drawn)
FID3  Fiducial  [Fiducial10-20]  (value not drawn)
FID4  Fiducial  [Fiducial10-20]  (value not drawn)
FID5  Fiducial  [Fiducial10-20]  (value not drawn)
FID6  Fiducial  [Fiducial10-20]  (value not drawn)
H1  Nut  [Keystone_2203]  (value not drawn)
H2  Nut  [Keystone_8402]  (value not drawn)
H3  SCREW  [B_F_PMSSS4400025PH]  (value not drawn)
H4  MechPart  (mechanical)
H5  Nut  [Keystone_2203]  (value not drawn)
H6  Nut  [Keystone_8402]  (value not drawn)
H7  SCREW  [B_F_PMSSS4400025PH]  (value not drawn)
H8  Nut  [Keystone_2203]  (value not drawn)
H9  Nut  [Keystone_8402]  (value not drawn)
H10  SCREW  [B_F_PMSSS4400025PH]  (value not drawn)
H11  SCREW  [B_F_PMSSS4400025PH]  (value not drawn)
H12  Nut  [Keystone_8402]  (value not drawn)
H13  Nut  [Keystone_2203]  (value not drawn)
H14  SCREW  [B_F_PMSSS4400025PH]  (value not drawn)
H15  Nut  [Keystone_8402]  (value not drawn)
H16  Nut  [Keystone_2203]  (value not drawn)
LBL1  Label  [Label_650x200]
Logo1  CE Mark  [CE_Mark_5mm]  (no BOM)
Logo2  FCC disclaimer  [FCC_disclaimer_stacked]  (no BOM)
Logo4  WEEE logo  [WEEE_Minimum]  (no BOM)
Logo5  Texas Instruments  [TI_Stacked_Overlay_Small]  (no BOM)
SH-1  SNT-100-BK-G  [SNT-100-BK-G]  (value not drawn)
SH-2  SNT-100-BK-G  [SNT-100-BK-G]  (value not drawn)
SH-3  SNT-100-BK-G  [SNT-100-BK-G]  (value not drawn)
SH-4  SNT-100-BK-G  [SNT-100-BK-G]  (value not drawn)
SH-5  Shunt  [SNT-100-BK-G]  (value not drawn)
SH-6  Shunt  [SNT-100-BK-G]  (value not drawn)
SH-7  Shunt  [SNT-100-BK-G]  (value not drawn)
SH-8  Shunt  [SNT-100-BK-G]  (value not drawn)
SH-9  Shunt  [SNT-100-BK-G]  (value not drawn)
SH-10  Shunt  [SNT-100-BK-G]  (value not drawn)
SH-11  Shunt  [SNT-100-BK-G]  (value not drawn)
SH-12  Shunt  [SNT-100-BK-G]  (value not drawn)
ZZ1  This Assembly Note is for PCB labels only  [AssemblyNoteLabel]  (no BOM)
ZZ2  These assemblies are ESD sensitive, ESD precautions shall be observed.  [AssemblyNote]  (no BOM)
ZZ3  These assemblies must be clean and free from flux and all contaminants. Use of no clean flux is not acceptable.  [AssemblyNote]  (no BOM)
ZZ4  These assemblies must comply with workmanship standards IPC-A-610 Class 2, unless otherwise specified.  [AssemblyNote]  (no BOM)
ZZ5  Indication for all LEDs has been marked with their cathode side.  [AssemblyNote]  (no BOM)

### Notes on the sheet
- MECHANICAL PARTS
- Keystone 2203 for LVDS.
- PMSSS 440 0025 PH
- Keystone 2203
- Keystone 8402 for JESD Capture Card
- Label Table
- Variant
- 001
- 002
- Label Text
- AFE5832LPEVM
- AFE58JD32LPEVM
- (near SH-1) Place SH-1 on J53
- (near SH-2) Place SH-2 on J55 pins 2-3
- (near SH-3) Place SH-3 on J54 pins 1-2
- (near SH-4) Place SH-4 on J57
- (near SH-5) Place SH-5 on J40 pins 3-5
- (near SH-6) Place SH-6 on J40 pins 4-6
- (near SH-7) Place SH-7 on J42 pins 1-3
- (near SH-8) Place SH-8 on J42 pins 2-4
- (near SH-9) Place SH-9 on J44 pins 3-5
- (near SH-10) Place SH-10 on J44 pins 4-6
- (near SH-11) Place SH-11 on J45 pins 3-5
- (near SH-12) Place SH-12 on J45 pins 4-6
- Drawn By:
- SVN Rev:
- Number:
- TID #:
- Orderable:
- Rev:
- Sheet Title:
- File:
- Project Title:
- Designed for:
- Assembly Variant:
- Mod. Date:
- Sheet:
- Size:
- of
- C
- http://www.ti.com
- Texas Instruments and/or its licensors do not warrant the accuracy or completeness of this specification or any information contained therein. Texas Instruments and/or its licensors do not warrant that this design will meet the specifications, will be suitable for your application or fit for any particular purpose, or will operate in an implementation. Texas Instruments and/or its licensors do not warrant that the design is production worthy. You should completely validate and test your design implementation to confirm the system functionality for your application.
- Engineer:
- Contact:
- © Texas Instruments
- (in symbol CMP-0003615-1) Assembly Note
- (in symbol CMP-0003616-3) Label Assembly Note
- (in symbol CMP-0003618-2) PCB Number:; PCB Rev:
- (in symbol CMP-0003625-1) PCB Label
- (in symbol CMP-0003778-1) MECH
- (in symbol CMP-0074769-1) PCB; LOGO
- (in symbol CMP-0074838-1) PCB; LOGO
- (in symbol CMP-0074847-1) PCB; LOGO

### Library data of the parts
!PCB = CMP-0003618-2: Manufacturer: Any; PartNumber: DC075; CompType: PCB; RoHS: O; MountType: N/A; Publisher: Texas Instruments; LatestRevisionDate: 2017-03-09; Key: PCB
FID1-FID6 = CMP-0077181-1: Fiducial mark.  There is nothing to buy or mount.; CompType: Fiducial; Manufacturer: N/A; MountType: N/A; PackageReference: N/A; PartNumber: N/A; ClassName: FiducialMark; Library Reference: Fiducial
H1 H5 H8 H13 H16 = CMP-0003779-1: HEX STANDOFF 4-40 ALUMINUM 1/2"; Manufacturer: Keystone; PartNumber: 2203; CompType: Standoff; RoHS: Y; PackageReference: HEX STANDOFF 4-40 ALUMINUM 1/2 inch; MountType: N/A; ComponentLink1Description: Datasheet Link; ComponentLink1URL: http://www.keyelco.com/product-pdf.cfm?p=4279; Publisher: Texas Instruments; LatestRevisionDate: 2017-03-09; Supplier 1: Digi-Key; Supplier Part Number 1: 36-2203-ND; Supplier 2: Newark; Supplier Part Number 2: 89F1952; Supplier 3: Mouser; Supplier Part Number 3: 534-2203; Key: 2203
H2 H6 H9 H12 H15 = CMP-0003797-1: HEX, M-F STANDOFF 4-40 ALUMINUM 1/2"; Manufacturer: Keystone; PartNumber: 8402; CompType: Standoff; RoHS: Y; PackageReference: HEX, M-F STANDOFF 4-40 ALUMINUM 1/2 inch; MountType: N/A; ComponentLink1Description: Datasheet Link; ComponentLink1URL: http://www.keyelco.com/product-pdf.cfm?p=4921; Publisher: Texas Instruments; LatestRevisionDate: 2017-03-09; Supplier 1: Digi-Key; Supplier Part Number 1: 36-8402-ND; Supplier 2: Newark; Supplier Part Number 2: 02M0659; Supplier 3: Mouser; Supplier Part Number 3: 534-8402; Key: 8402
H3 H7 H10 H11 H14 = CMP-0003715-1: MACHINE SCREW PAN PHILLIPS 4-40; Manufacturer: B&F Fastener Supply; PartNumber: PMSSS 440 0025 PH; CompType: Standoff; RoHS: Y; PackageReference: Machine Screw, 4-40, 1/4 inch; MountType: TH; ComponentLink1Description: Datasheet Link; ComponentLink1URL: http://www.fasnetdirect.com/refguide/Machinepancombo.pdf; Publisher: Texas Instruments; LatestRevisionDate: 2017-03-09; Supplier 1: Digi-Key; Supplier Part Number 1: H703-ND; Key: PMSSS 440 0025 PH
H4 = CMP-0003778-1: CABLE ASSY STR 2.1MM 6' 24 AWG - Kitting item; Manufacturer: Tensility; PartNumber: CA-2185; CompType: Cable; RoHS: Y; MountType: N/A; ComponentLink1Description: Datasheet Link; ComponentLink1URL: http://www.tensility.com/pdffiles/053-0184R.pdf; Publisher: Texas Instruments; LatestRevisionDate: 2017-03-09; Supplier 1: Digi-Key; Supplier Part Number 1: CP-2185-ND; Key: CA-2185
LBL1 = CMP-0003625-1: Thermal Transfer Printable Labels, 0.650" W x 0.200" H - 10,000 per roll; Manufacturer: Brady; PartNumber: THT-14-423-10; Note: Size: 0.65" x 0.20 "; ClassName: Label; CompType: Label; RoHS: Y; PackageReference: PCB Label 0.650 x 0.200 inch; MountType: N/A; ComponentLink1Description: Web Page; ComponentLink1URL: http://www.bradyid.com/bradyid/pdpv/THT-14-423-10.html; Publisher: Texas Instruments; LatestRevisionDate: 2017-03-09; Supplier 1: Newark; Supplier Part Number 1: 97C5133; Supplier 2: Farnell; Supplier Part Number 2: 2065596; Key: THT-14-423-10
Logo1 = CMP-0074844-1: SymbolCreator: a0412235; Published: 2009-03-03; Publisher: Texas Instruments; LatestRevisionDate: 2017-07-06; Lib Reference: CE Mark; PartNumber: CE Mark; Library Reference: CE Mark
Logo2 = CMP-0074847-1: FCC_disclaimer; Published: 2009-03-03; Publisher: Texas Instruments; LatestRevisionDate: 2017-07-06; Lib Reference: FCC_disclaimer; PartNumber: FCC disclaimer; Library Reference: Logo
Logo4 = CMP-0074769-1: Library Reference: WEEE logo; Lib Reference: WEEE logo; PartNumber: WEEE logo
Logo5 = CMP-0074838-1: Texas Instrument Corporate Signature; SymbolCreator: a0412235; Lib Reference: TI_Logo; SymbolVersion: 2011-08-22; Published: 2009-03-03; Publisher: Texas Instruments; ClassName: Logo; LatestRevisionDate: 2017-07-06; PartNumber: Texas Instruments; Library Reference: Logo
SH-1-SH-12 = CMP-0003623-3: Shunt, 100mil, Gold plated, Black; Manufacturer: Samtec; Alternate Manufacturer: 3M; Alternate PartNumber: 969102-0000-DA; Value: 1x2; Note: You can "mate" this to a header by matching the designator.  i.e. use SH-J3 for header J3; ClassName: Shunt; CompType: Shunt; PartNumber: SNT-100-BK-G; RoHS: Y; PackageReference: Shunt; MountType: N/A; ComponentLink1Description: Datasheet Link; ComponentLink1URL: http://www.samtec.com/ftppub/pdf/SNT.PDF; Supplier 1: Digi-Key; Supplier Part Number 1: SAM8858-ND
ZZ1 = CMP-0003616-3: CompType: AssemblyNote; ClassName: AssemblyNote; Publisher: Texas Instruments; LatestRevisionDate: 2017-03-09; Key: AssemblyNoteLabel
ZZ2 = CMP-0077236-1: CompType: AssemblyNote; ClassName: AssemblyNote; Publisher: Texas Instruments; LatestRevisionDate: 2017-08-10; Key: AssemblyNote
ZZ3 = CMP-0077237-1: CompType: AssemblyNote; ClassName: AssemblyNote; Publisher: Texas Instruments; LatestRevisionDate: 2017-08-10; Key: AssemblyNote
ZZ4 = CMP-0077238-1: CompType: AssemblyNote; ClassName: AssemblyNote; Publisher: Texas Instruments; LatestRevisionDate: 2017-08-10; Key: AssemblyNote
ZZ5 = CMP-0003615-1: This Assembly Note will show in the PcbDoc and associated outputs; Key: AssemblyNote; Publisher: Texas Instruments; CompType: AssemblyNote; LatestRevisionDate: 2017-03-09; ClassName: AssemblyNote

## Nets that join several sheets
3.3VD: DC075B_POWER_SUPPLIES (D10.1 FB26.2 TP58.1), DC075B_USB (FB1.2), DC075B_JESD_OUTPUT (U3.8)
+1.8VD: DC075B_POWER_SUPPLIES (6 pins), DC075B_USB (C218.2 R102.1 U13.2), DC075B_DECOUPLING (C75.1 J35.2 J36.2 S1.1), DC075B_DTGC_CPLD (FB12.2)
+3.3VD: DC075B_POWER_SUPPLIES (C187.1 FB18.1 U6.4), DC075B_INPUT_CLOCKS (J41.1), DC075B_DTGC_CPLD (FB13.2)
AGND: DC075B_ANALOG_INPUTS (389 pins), DC075B_DEVICE_PINOUT (C176.2 C177.2 C178.2)
AVDD_1.8: DC075B_POWER_SUPPLIES (FB15.2), DC075B_DEVICE_PINOUT (8 pins), DC075B_DECOUPLING (C71.1 C72.1 C73.1)
AVDD_3.0: DC075B_POWER_SUPPLIES (D9.1 FB24.2 TP56.1), DC075B_DEVICE_PINOUT (5 pins), DC075B_DECOUPLING (C85.1 C86.1)
AVDD_VCA_1.8: DC075B_POWER_SUPPLIES (D11.1 FB30.2 TP57.1), DC075B_DEVICE_PINOUT (17 pins), DC075B_DECOUPLING (6 pins)
DVDD_1.2: DC075B_POWER_SUPPLIES (FB20.2), DC075B_DEVICE_PINOUT (21 pins), DC075B_DECOUPLING (7 pins)
DVDD_1.8: DC075B_POWER_SUPPLIES (FB16.2), DC075B_DEVICE_PINOUT (10 pins), DC075B_DECOUPLING (C82.1 C83.1 C84.1)
GND: DC075B_POWER_SUPPLIES (54 pins), DC075B_USB (11 pins), DC075B_INPUT_CLOCKS (34 pins), DC075B_LMK_CLOCK_CIRCUIT (60 pins), DC075B_ANALOG_INPUTS (R188.1 R189.1 T1.1), DC075B_DEVICE_PINOUT (54 pins), DC075B_DECOUPLING (34 pins), DC075B_TGC_SOURCE (8 pins), DC075B_DTGC_CPLD (27 pins), DC075B_LVDS_OUTPUT (84 pins), DC075B_JESD_OUTPUT (161 pins), DC075B_CW_OUTPUTS (46 pins)
LMKBUF_VCC: DC075B_POWER_SUPPLIES (FB18.2), DC075B_INPUT_CLOCKS (U2.1 U2.8 U2.9 U2.12), DC075B_LMK_CLOCK_CIRCUIT (15 pins)
OPAMP+: DC075B_POWER_SUPPLIES (FB28.2), DC075B_CW_OUTPUTS (20 pins)
OPAMP-: DC075B_POWER_SUPPLIES (FB21.2), DC075B_CW_OUTPUTS (20 pins)
ADC_CLKM: DC075B_INPUT_CLOCKS (J42.4), DC075B_DEVICE_PINOUT (C172.2)
ADC_CLKP: DC075B_INPUT_CLOCKS (J42.3), DC075B_DEVICE_PINOUT (C171.2)
AFE_RESET: DC075B_USB (R139.1), DC075B_DEVICE_PINOUT (U1.L17), DC075B_DECOUPLING (C75.2 S1.2)
CLKM_1X: DC075B_INPUT_CLOCKS (J45.3), DC075B_DEVICE_PINOUT (C170.2)
CLKM_16X: DC075B_INPUT_CLOCKS (J44.3), DC075B_DEVICE_PINOUT (C168.2)
CLKP_1X: DC075B_INPUT_CLOCKS (J45.4), DC075B_DEVICE_PINOUT (C169.2)
CLKP_16X: DC075B_INPUT_CLOCKS (J44.4), DC075B_DEVICE_PINOUT (C167.2)
CLKsrc_SE_2: DC075B_INPUT_CLOCKS (R52.1 Y1.3), DC075B_LMK_CLOCK_CIRCUIT (J54.3)
CML1_OUTM: DC075B_DEVICE_PINOUT (U1.P17), DC075B_JESD_OUTPUT (C110.2)
CML1_OUTP: DC075B_DEVICE_PINOUT (U1.N17), DC075B_JESD_OUTPUT (C107.2)
CML2_OUTM: DC075B_DEVICE_PINOUT (U1.T17), DC075B_JESD_OUTPUT (C116.2)
CML2_OUTP: DC075B_DEVICE_PINOUT (U1.R17), DC075B_JESD_OUTPUT (C114.2)
CML3_OUTM: DC075B_DEVICE_PINOUT (U1.U16), DC075B_JESD_OUTPUT (C121.2)
CML3_OUTP: DC075B_DEVICE_PINOUT (U1.U17), DC075B_JESD_OUTPUT (C119.2)
CML4_OUTM: DC075B_DEVICE_PINOUT (U1.U14), DC075B_JESD_OUTPUT (C125.2)
CML4_OUTP: DC075B_DEVICE_PINOUT (U1.U15), DC075B_JESD_OUTPUT (C123.2)
CML5_OUTM: DC075B_DEVICE_PINOUT (U1.P1), DC075B_JESD_OUTPUT (C111.2)
CML5_OUTP: DC075B_DEVICE_PINOUT (U1.N1), DC075B_JESD_OUTPUT (C108.2)
CML6_OUTM: DC075B_DEVICE_PINOUT (U1.T1), DC075B_JESD_OUTPUT (C117.2)
CML6_OUTP: DC075B_DEVICE_PINOUT (U1.R1), DC075B_JESD_OUTPUT (C113.2)
CML7_OUTM: DC075B_DEVICE_PINOUT (U1.U2), DC075B_JESD_OUTPUT (C122.2)
CML7_OUTP: DC075B_DEVICE_PINOUT (U1.U1), DC075B_JESD_OUTPUT (C120.2)
CML8_OUTM: DC075B_DEVICE_PINOUT (U1.U4), DC075B_JESD_OUTPUT (C126.2)
CML8_OUTP: DC075B_DEVICE_PINOUT (U1.U3), DC075B_JESD_OUTPUT (C124.2)
CPLD_CLK_M: DC075B_LMK_CLOCK_CIRCUIT (U4.28), DC075B_DTGC_CPLD (U21.12)
CPLD_CLK_P: DC075B_LMK_CLOCK_CIRCUIT (TP46.1 U4.27), DC075B_DTGC_CPLD (U21.11)
CPLD_IO_1: DC075B_DECOUPLING (R36.1), DC075B_DTGC_CPLD (J59.1 U21.44)
CPLD_IO_2: DC075B_ANALOG_INPUTS (T1.3), DC075B_DTGC_CPLD (U21.43)
CPLD_IO_4: DC075B_DEVICE_PINOUT (U1.J14), DC075B_DECOUPLING (C87.1 J38.2 R35.2), DC075B_DTGC_CPLD (J60.1 U21.38)
CPLD_IO_5: DC075B_DECOUPLING (C88.1 J38.4 R35.1 R39.2), DC075B_DTGC_CPLD (J60.3 U21.37)
CPLD_IO_6: DC075B_DECOUPLING (C90.1 J38.6 R39.1 R42.2), DC075B_DTGC_CPLD (J60.5 U21.36)
CPLD_IO_7: DC075B_DECOUPLING (C91.1 J38.8 R42.1), DC075B_DTGC_CPLD (J60.7 U21.35)
CPLD_SL: DC075B_TGC_SOURCE (R72.1), DC075B_DTGC_CPLD (U21.27)
CPLD_UD: DC075B_TGC_SOURCE (R70.1), DC075B_DTGC_CPLD (U21.26)
CW1X_CLEAN_N: DC075B_INPUT_CLOCKS (J45.5), DC075B_LMK_CLOCK_CIRCUIT (U4.23)
CW1X_CLEAN_P: DC075B_INPUT_CLOCKS (J45.6), DC075B_LMK_CLOCK_CIRCUIT (U4.22)
CW16X_CLEAN_N: DC075B_INPUT_CLOCKS (J44.5), DC075B_LMK_CLOCK_CIRCUIT (U4.25)
CW16X_CLEAN_P: DC075B_INPUT_CLOCKS (J44.6), DC075B_LMK_CLOCK_CIRCUIT (U4.24)
CW_I_OUT_M: DC075B_DEVICE_PINOUT (U1.F2), DC075B_CW_OUTPUTS (R159.2 R160.1)
CW_I_OUT_P: DC075B_DEVICE_PINOUT (U1.F1), DC075B_CW_OUTPUTS (R157.2 R158.2)
CW_Q_OUT_M: DC075B_DEVICE_PINOUT (U1.G2), DC075B_CW_OUTPUTS (R167.2 R168.1)
CW_Q_OUT_P: DC075B_DEVICE_PINOUT (U1.G1), DC075B_CW_OUTPUTS (R163.2 R164.2)
DCLKM: DC075B_DEVICE_PINOUT (U1.U9), DC075B_LVDS_OUTPUT (J48.56)
DCLKP: DC075B_DEVICE_PINOUT (U1.T9), DC075B_LVDS_OUTPUT (J48.58)
DIG_SPI_EN: DC075B_USB (J64.5 R137.2 U13.6), DC075B_DEVICE_PINOUT (U1.K16)
DOUTM1: DC075B_DEVICE_PINOUT (U1.T16), DC075B_LVDS_OUTPUT (J48.14)
DOUTM2: DC075B_DEVICE_PINOUT (U1.T15), DC075B_LVDS_OUTPUT (J48.20)
DOUTM3: DC075B_DEVICE_PINOUT (U1.T14), DC075B_LVDS_OUTPUT (J48.26)
DOUTM4: DC075B_DEVICE_PINOUT (U1.U13), DC075B_LVDS_OUTPUT (J48.32)
DOUTM5: DC075B_DEVICE_PINOUT (U1.U12), DC075B_LVDS_OUTPUT (J48.38)
DOUTM6: DC075B_DEVICE_PINOUT (U1.R11), DC075B_LVDS_OUTPUT (J48.44)
DOUTM7: DC075B_DEVICE_PINOUT (U1.U11), DC075B_LVDS_OUTPUT (J48.50)
DOUTM8: DC075B_DEVICE_PINOUT (U1.U10), DC075B_LVDS_OUTPUT (J48.70)
DOUTM9: DC075B_DEVICE_PINOUT (U1.U8), DC075B_LVDS_OUTPUT (J48.69)
DOUTM10: DC075B_DEVICE_PINOUT (U1.U7), DC075B_LVDS_OUTPUT (J48.76)
DOUTM11: DC075B_DEVICE_PINOUT (U1.R6), DC075B_LVDS_OUTPUT (J48.82)
DOUTM12: DC075B_DEVICE_PINOUT (U1.U6), DC075B_LVDS_OUTPUT (J48.88)
DOUTM13: DC075B_DEVICE_PINOUT (U1.U5), DC075B_LVDS_OUTPUT (J48.94)
DOUTM14: DC075B_DEVICE_PINOUT (U1.T4), DC075B_LVDS_OUTPUT (J48.100)
DOUTM15: DC075B_DEVICE_PINOUT (U1.T3), DC075B_LVDS_OUTPUT (J48.106)
DOUTM16: DC075B_DEVICE_PINOUT (U1.T2), DC075B_LVDS_OUTPUT (J48.112)
DOUTP1: DC075B_DEVICE_PINOUT (U1.R16), DC075B_LVDS_OUTPUT (J48.16)
DOUTP2: DC075B_DEVICE_PINOUT (U1.R15), DC075B_LVDS_OUTPUT (J48.22)
DOUTP3: DC075B_DEVICE_PINOUT (U1.R14), DC075B_LVDS_OUTPUT (J48.28)
DOUTP4: DC075B_DEVICE_PINOUT (U1.T13), DC075B_LVDS_OUTPUT (J48.34)
DOUTP5: DC075B_DEVICE_PINOUT (U1.T12), DC075B_LVDS_OUTPUT (J48.40)
DOUTP6: DC075B_DEVICE_PINOUT (U1.R12), DC075B_LVDS_OUTPUT (J48.46)
DOUTP7: DC075B_DEVICE_PINOUT (U1.T11), DC075B_LVDS_OUTPUT (J48.52)
DOUTP8: DC075B_DEVICE_PINOUT (U1.T10), DC075B_LVDS_OUTPUT (J48.72)
DOUTP9: DC075B_DEVICE_PINOUT (U1.T8), DC075B_LVDS_OUTPUT (J48.71)
DOUTP10: DC075B_DEVICE_PINOUT (U1.T7), DC075B_LVDS_OUTPUT (J48.78)
DOUTP11: DC075B_DEVICE_PINOUT (U1.R7), DC075B_LVDS_OUTPUT (J48.84)
DOUTP12: DC075B_DEVICE_PINOUT (U1.T6), DC075B_LVDS_OUTPUT (J48.90)
DOUTP13: DC075B_DEVICE_PINOUT (U1.T5), DC075B_LVDS_OUTPUT (J48.96)
DOUTP14: DC075B_DEVICE_PINOUT (U1.R4), DC075B_LVDS_OUTPUT (J48.102)
DOUTP15: DC075B_DEVICE_PINOUT (U1.R3), DC075B_LVDS_OUTPUT (J48.108)
DOUTP16: DC075B_DEVICE_PINOUT (U1.R2), DC075B_LVDS_OUTPUT (J48.114)
FCLKM: DC075B_DEVICE_PINOUT (U1.R8), DC075B_LVDS_OUTPUT (J48.64)
FCLKP: DC075B_DEVICE_PINOUT (U1.R10), DC075B_LVDS_OUTPUT (J48.66)
FPGA_CLK_OUT_M: DC075B_LMK_CLOCK_CIRCUIT (R81.2 U4.52), DC075B_JESD_OUTPUT (C112.1)
FPGA_CLK_OUT_P: DC075B_LMK_CLOCK_CIRCUIT (R80.1 TP47.1 U4.51), DC075B_JESD_OUTPUT (C109.1)
FPGA_GTXCLK_M: DC075B_LMK_CLOCK_CIRCUIT (R75.2 U4.2), DC075B_JESD_OUTPUT (J47.D5)
FPGA_GTXCLK_P: DC075B_LMK_CLOCK_CIRCUIT (R74.1 TP42.1 U4.1), DC075B_JESD_OUTPUT (J47.D4)
FPGA_SYSREFM: DC075B_LMK_CLOCK_CIRCUIT (R79.2 U4.4), DC075B_JESD_OUTPUT (C118.1)
FPGA_SYSREFP: DC075B_LMK_CLOCK_CIRCUIT (R78.1 TP43.1 U4.3), DC075B_JESD_OUTPUT (C115.1)
LMK_ADC_CLK_DIV_CMOS: DC075B_INPUT_CLOCKS (U2.7), DC075B_DTGC_CPLD (R112.1)
LMK_ADC_CLKN: DC075B_INPUT_CLOCKS (R55.2 U2.3), DC075B_LMK_CLOCK_CIRCUIT (U4.16)
LMK_ADC_CLKP: DC075B_INPUT_CLOCKS (R54.2 U2.2), DC075B_LMK_CLOCK_CIRCUIT (TP44.1 U4.15)
LMK_CLKIN2_N: DC075B_LMK_CLOCK_CIRCUIT (U4.41), DC075B_JESD_OUTPUT (J47.K5)
LMK_CLKIN2_P: DC075B_LMK_CLOCK_CIRCUIT (U4.40), DC075B_JESD_OUTPUT (J47.K4)
LMK_CS: DC075B_USB (U14.12), DC075B_LMK_CLOCK_CIRCUIT (U4.18)
LMK_SYNC: DC075B_LMK_CLOCK_CIRCUIT (TP49.1 U4.6), DC075B_JESD_OUTPUT (J47.K22)
PDN_FAST: DC075B_DEVICE_PINOUT (U1.M17), DC075B_DECOUPLING (J36.1)
PDN_GLOBAL: DC075B_DEVICE_PINOUT (U1.M16), DC075B_DECOUPLING (J35.1)
SCLK: DC075B_USB (J64.3 R135.2 U13.5), DC075B_LMK_CLOCK_CIRCUIT (U4.19), DC075B_DEVICE_PINOUT (U1.J17)
SDATA: DC075B_USB (J64.4 R136.2 U13.4), DC075B_LMK_CLOCK_CIRCUIT (U4.20), DC075B_DEVICE_PINOUT (U1.L16)
SDOUT: DC075B_USB (J64.6 R138.2 U13.7), DC075B_DEVICE_PINOUT (U1.J16)
SENT: DC075B_USB (J64.1 R133.2 U13.1), DC075B_DEVICE_PINOUT (R103.1)
SYNCM_SERDES: DC075B_DEVICE_PINOUT (C248.2 R181.1 R182.1), DC075B_JESD_OUTPUT (R61.2)
SYNCP_SERDES: DC075B_DEVICE_PINOUT (C227.2 R180.1 R181.2), DC075B_JESD_OUTPUT (R60.2)
SYSREFM_EXT: DC075B_DEVICE_PINOUT (C166.2 R187.1), DC075B_JESD_OUTPUT (J47.J3)
SYSREFM_SERDES: DC075B_LMK_CLOCK_CIRCUIT (U4.14), DC075B_DEVICE_PINOUT (C164.2 R183.1)
SYSREFP_EXT: DC075B_DEVICE_PINOUT (C165.2 R187.2), DC075B_JESD_OUTPUT (J47.J2)
SYSREFP_SERDES: DC075B_LMK_CLOCK_CIRCUIT (TP45.1 U4.13), DC075B_DEVICE_PINOUT (C163.2 R183.2)
TGC_PROF_1: DC075B_DEVICE_PINOUT (U1.J5), DC075B_TGC_SOURCE (C127.1 R62.2 R66.2 TP36.1)
TGC_PROF_2: DC075B_DEVICE_PINOUT (U1.H5), DC075B_TGC_SOURCE (C129.1 R65.2 R67.2 TP38.1)
TGC_SLOPE: DC075B_DEVICE_PINOUT (U1.H4), DC075B_TGC_SOURCE (R73.1)
TGC_UP_DN: DC075B_DEVICE_PINOUT (U1.J4), DC075B_TGC_SOURCE (R71.1)
TSW_GPIO_0: DC075B_TGC_SOURCE (R66.1), DC075B_LVDS_OUTPUT (J48.105), DC075B_JESD_OUTPUT (J47.C14)
TSW_GPIO_1: DC075B_TGC_SOURCE (R67.1), DC075B_LVDS_OUTPUT (J48.107), DC075B_JESD_OUTPUT (J47.C15)
TSW_GPIO_2: DC075B_TGC_SOURCE (R68.1), DC075B_LVDS_OUTPUT (J48.109), DC075B_JESD_OUTPUT (J47.D14)
TSW_GPIO_3: DC075B_TGC_SOURCE (R69.1), DC075B_LVDS_OUTPUT (J48.111), DC075B_JESD_OUTPUT (J47.D15)
TSW_GPIO_4: DC075B_USB (R133.1), DC075B_LVDS_OUTPUT (J48.113), DC075B_JESD_OUTPUT (J47.G15)
TSW_GPIO_5: DC075B_USB (R134.1), DC075B_DECOUPLING (R37.1), DC075B_LVDS_OUTPUT (J48.115), DC075B_JESD_OUTPUT (J47.G16)
TSW_GPIO_6: DC075B_USB (R135.1), DC075B_LVDS_OUTPUT (J48.117), DC075B_JESD_OUTPUT (J47.H16)
TSW_GPIO_7: DC075B_USB (R136.1), DC075B_LVDS_OUTPUT (J48.118), DC075B_JESD_OUTPUT (J47.H17)
TSW_GPIO_8: DC075B_USB (R137.1), DC075B_JESD_OUTPUT (J47.H2)
TSW_GPIO_9: DC075B_USB (R138.1), DC075B_JESD_OUTPUT (J47.C18)
TX_TRG: DC075B_DEVICE_PINOUT (U1.M15), DC075B_DECOUPLING (C89.2 R40.2 TP35.1), DC075B_DTGC_CPLD (U21.30)

## Assembly variants
001: not fitted C89 C128 C130 C156 C165 C166 C247 C260 FB13 FID1 FID2 FID3 FID4 FID5 FID6 J64 R33 R35 R37 R39 R42 R54 R55 R63 R64 R66 R67 R68 R69 R74 R75 R78 R79 R80 R81 R82 R89 R90 R94 R96 R98 R99 R101 R104 R113 R133 R134 R135 R136 R137 R138 R157 R160 R163 R166 R168 R173 R176 R178 R187 R190 TP1 TP2 TP3 TP4 TP5 TP6 TP7 TP8 TP9 TP10 TP11 TP12 TP13 TP14 TP15 TP16 TP17 TP18 TP19 TP20 TP21 TP22 TP23 TP24 TP25 TP26 TP27 TP28 TP29 TP30 TP33 TP34 TP40 TP41 TP42 TP43 TP44 TP45 TP46 TP47 TP49
002: not fitted C89 C128 C130 C156 C163 C164 C165 C166 C227 C247 C248 C260 FB13 FID1 FID2 FID3 FID4 FID5 FID6 J47 J64 R33 R35 R37 R39 R42 R54 R55 R63 R64 R66 R67 R68 R69 R74 R75 R78 R79 R80 R81 R82 R89 R90 R94 R96 R98 R99 R101 R104 R113 R133 R134 R135 R136 R137 R138 R157 R160 R163 R166 R168 R173 R176 R178 R179 R180 R181 R182 R183 R184 R185 R186 R187 R190 TP1 TP2 TP3 TP4 TP5 TP6 TP7 TP8 TP9 TP10 TP11 TP12 TP13 TP14 TP15 TP16 TP17 TP18 TP19 TP20 TP21 TP22 TP23 TP24 TP25 TP26 TP27 TP28 TP29 TP30 TP33 TP34 TP40 TP41 TP42 TP43 TP44 TP45 TP46 TP47 TP49; alternate parts U1 -> CMP-0084576-3